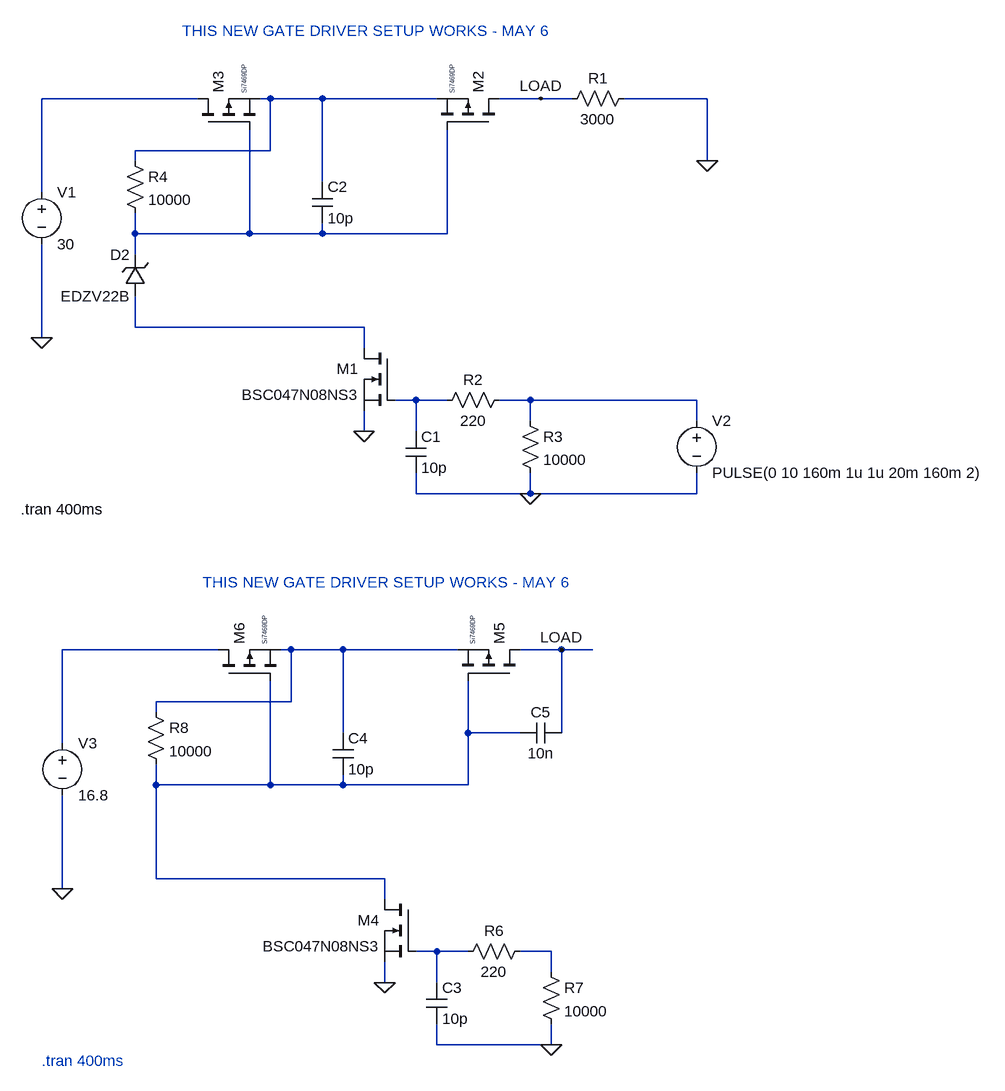
[diagram p0: schematic PMOS Bidirectional Switch Prototype 2.asc]
PMOS Bidirectional Switch Prototype 2.asc, the LTspice schematic file:
Version 4.1
SHEET 1 984 1288
WIRE -624 -208 -864 -208
WIRE -512 -208 -528 -208
WIRE -432 -208 -512 -208
WIRE -256 -208 -432 -208
WIRE -96 -208 -160 -208
WIRE -48 -208 -96 -208
WIRE 160 -208 32 -208
WIRE -512 -128 -512 -208
WIRE -512 -128 -720 -128
WIRE -720 -112 -720 -128
WIRE 160 -112 160 -208
WIRE -432 -80 -432 -208
WIRE -864 -64 -864 -208
WIRE -720 0 -720 -32
WIRE -544 0 -544 -160
WIRE -544 0 -720 0
WIRE -432 0 -432 -16
WIRE -432 0 -544 0
WIRE -240 0 -240 -160
WIRE -240 0 -432 0
WIRE -720 32 -720 0
WIRE -720 144 -720 96
WIRE -368 144 -720 144
WIRE -864 160 -864 16
WIRE -368 176 -368 144
WIRE -288 256 -320 256
WIRE -240 256 -288 256
WIRE -112 256 -160 256
WIRE 144 256 -112 256
WIRE -112 288 -112 256
WIRE 144 288 144 256
WIRE -368 304 -368 272
WIRE -288 304 -288 256
WIRE -288 400 -288 368
WIRE -112 400 -112 368
WIRE -112 400 -288 400
WIRE 144 400 144 368
WIRE 144 400 -112 400
WIRE -592 640 -832 640
WIRE -480 640 -496 640
WIRE -400 640 -480 640
WIRE -224 640 -400 640
WIRE -64 640 -128 640
WIRE -16 640 -64 640
WIRE -480 720 -480 640
WIRE -480 720 -688 720
WIRE -688 736 -688 720
WIRE -400 768 -400 640
WIRE -208 768 -208 688
WIRE -128 768 -208 768
WIRE -64 768 -64 640
WIRE -832 784 -832 640
WIRE -688 848 -688 816
WIRE -512 848 -512 688
WIRE -512 848 -688 848
WIRE -400 848 -400 832
WIRE -400 848 -512 848
WIRE -208 848 -208 768
WIRE -208 848 -400 848
WIRE -688 992 -688 848
WIRE -336 992 -688 992
WIRE -832 1008 -832 864
WIRE -336 1024 -336 992
WIRE -256 1104 -288 1104
WIRE -208 1104 -256 1104
WIRE -80 1104 -128 1104
WIRE -80 1136 -80 1104
WIRE -336 1152 -336 1120
WIRE -256 1152 -256 1104
WIRE -256 1248 -256 1216
WIRE -80 1248 -80 1216
WIRE -80 1248 -256 1248
FLAG 160 -112 0
FLAG -864 160 0
FLAG -368 304 0
FLAG -112 400 0
FLAG -96 -208 LOAD
FLAG -832 1008 0
FLAG -336 1152 0
FLAG -80 1248 0
FLAG -64 640 LOAD
SYMBOL res 48 -224 R90
WINDOW 0 0 56 VBottom 2
WINDOW 3 32 56 VTop 2
SYMATTR InstName R1
SYMATTR Value 3000
SYMBOL voltage -864 -80 R0
WINDOW 123 0 0 Left 0
WINDOW 39 24 124 Left 2
SYMATTR InstName V1
SYMATTR Value 30
SYMBOL nmos -320 176 M0
SYMATTR InstName M1
SYMATTR Value BSC047N08NS3
SYMBOL voltage 144 272 R0
WINDOW 123 0 0 Left 0
WINDOW 39 0 0 Left 0
SYMATTR InstName V2
SYMATTR Value PULSE(0 10 160m 1u 1u 20m 160m 2)
SYMBOL res -144 240 R90
WINDOW 0 0 56 VBottom 2
WINDOW 3 32 56 VTop 2
SYMATTR InstName R2
SYMATTR Value 220
SYMBOL res -128 272 R0
SYMATTR InstName R3
SYMATTR Value 10000
SYMBOL cap -304 304 R0
SYMATTR InstName C1
SYMATTR Value 10p
SYMBOL res -736 -128 R0
SYMATTR InstName R4
SYMATTR Value 10000
SYMBOL cap -448 -80 R0
SYMATTR InstName C2
SYMATTR Value 10p
SYMBOL pmos -160 -160 M270
WINDOW 3 56 72 Left 0
SYMATTR Value Si7469DP
SYMATTR InstName M2
SYMBOL pmos -624 -160 R270
WINDOW 3 56 72 Left 0
SYMATTR Value Si7469DP
SYMATTR InstName M3
SYMBOL zener -704 96 R180
WINDOW 0 24 64 Left 2
WINDOW 3 24 0 Left 2
SYMATTR InstName D2
SYMATTR Value EDZV22B
SYMBOL voltage -832 768 R0
WINDOW 123 0 0 Left 0
WINDOW 39 24 124 Left 2
SYMATTR InstName V3
SYMATTR Value 16.8
SYMBOL nmos -288 1024 M0
SYMATTR InstName M4
SYMATTR Value BSC047N08NS3
SYMBOL res -112 1088 R90
WINDOW 0 0 56 VBottom 2
WINDOW 3 32 56 VTop 2
SYMATTR InstName R6
SYMATTR Value 220
SYMBOL res -96 1120 R0
SYMATTR InstName R7
SYMATTR Value 10000
SYMBOL cap -272 1152 R0
SYMATTR InstName C3
SYMATTR Value 10p
SYMBOL res -704 720 R0
SYMATTR InstName R8
SYMATTR Value 10000
SYMBOL cap -416 768 R0
SYMATTR InstName C4
SYMATTR Value 10p
SYMBOL pmos -128 688 M270
WINDOW 3 56 72 Left 0
SYMATTR Value Si7469DP
SYMATTR InstName M5
SYMBOL pmos -592 688 R270
WINDOW 3 56 72 Left 0
SYMATTR Value Si7469DP
SYMATTR InstName M6
SYMBOL cap -64 752 R90
WINDOW 0 0 32 VBottom 2
WINDOW 3 32 32 VTop 2
SYMATTR InstName C5
SYMATTR Value 10n
TEXT -648 -312 Left 2 ;THIS NEW GATE DRIVER SETUP WORKS - MAY 6
TEXT -896 424 Left 2 !.tran 400ms
TEXT -616 536 Left 2 ;THIS NEW GATE DRIVER SETUP WORKS - MAY 6
TEXT -864 1272 Left 2 ;.tran 400ms

The netlist it stands for:
* PMOS Bidirectional Switch Prototype 2.asc
R1 0 LOAD 3000
V1 N001 0 30
M1 N004 N005 0 0 BSC047N08NS3
V2 N006 0 PULSE(0 10 160m 1u 1u 20m 160m 2)
R2 N006 N005 220
R3 N006 0 10000
C1 N005 0 10p
R4 N002 N003 10000
C2 N002 N003 10p
M2 LOAD N003 N002 N002 Si7469DP
M3 N001 N003 N002 N002 Si7469DP
D2 N004 N003 EDZV22B
V3 N007 0 16.8
M4 N009 N010 0 0 BSC047N08NS3
R6 N011 N010 220
R7 N011 0 10000
C3 N010 0 10p
R8 N008 N009 10000
C4 N008 N009 10p
M5 LOAD N009 N008 N008 Si7469DP
M6 N007 N009 N008 N008 Si7469DP
C5 LOAD N009 10n
.model D D
.lib standard.dio
.model NMOS NMOS
.model PMOS PMOS
.lib standard.mos
* THIS NEW GATE DRIVER SETUP WORKS - MAY 6
.tran 400ms
* THIS NEW GATE DRIVER SETUP WORKS - MAY 6
* .tran 400ms
.backanno
.end